# EAGLE design ice header adapter pcb (EAGLE 7.1.0)
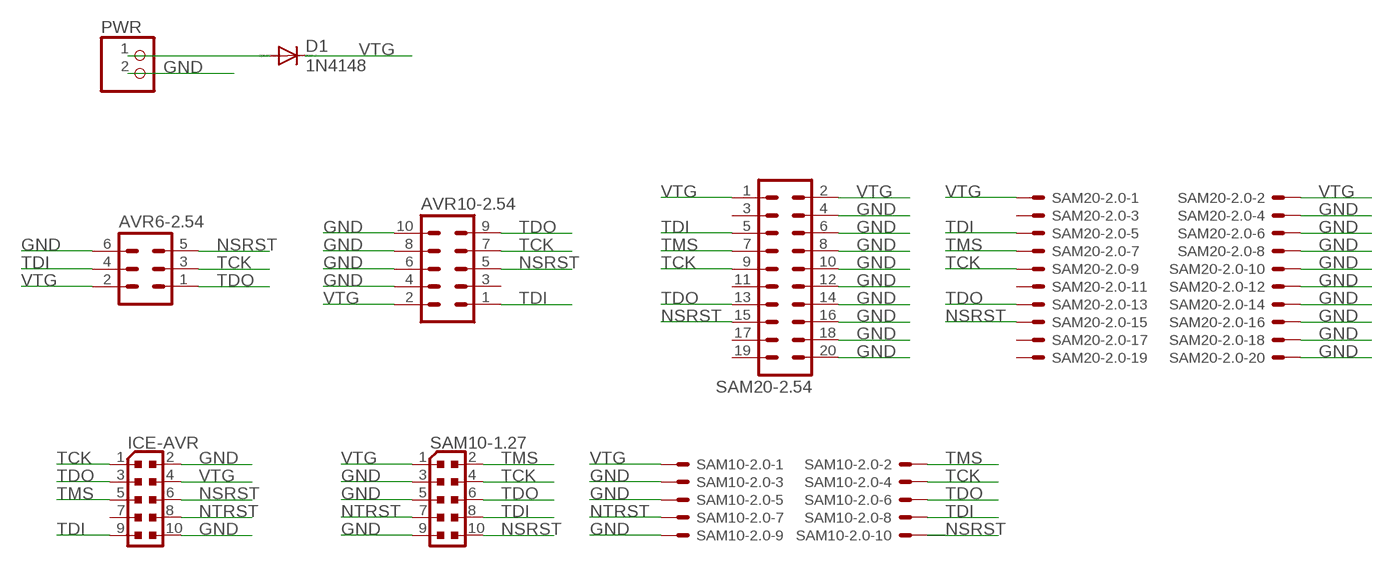
[diagram p0: schematic, sheet 1]

## Parts
AVR6-2.54  ML6  [ML6]
AVR10-2.54  ML10  [ML10]
D1  1N4148  1N4148DO35-7  [DO35-7]
ICE-AVR  PINHEAD_PINHD-2X5PASSO127  [PINHEAD_2X05_127]
PWR  PINHD-1X2/90  [1X02/90]
SAM10-1.27  PINHEAD_PINHD-2X5PASSO127  [PINHEAD_2X05_127]
SAM10-2.0  87758-1016  [87758-1016]
SAM20-2.0  87758-2016  [87758-2016]
SAM20-2.54  ML20  [ML20]

## Nets
GND [pwr]: AVR6-2.54.6 AVR10-2.54.4 AVR10-2.54.6 AVR10-2.54.8 AVR10-2.54.10 ICE-AVR.2 ICE-AVR.10 PWR.2 SAM10-1.27.3 SAM10-1.27.5 SAM10-1.27.9 SAM10-2.0.3 SAM10-2.0.5 SAM10-2.0.9 SAM20-2.0.4 SAM20-2.0.6 SAM20-2.0.8 SAM20-2.0.10 SAM20-2.0.12 SAM20-2.0.14 SAM20-2.0.16 SAM20-2.0.18 SAM20-2.0.20 SAM20-2.54.4 SAM20-2.54.6 SAM20-2.54.8 SAM20-2.54.10 SAM20-2.54.12 SAM20-2.54.14 SAM20-2.54.16 SAM20-2.54.18 SAM20-2.54.20
N$2: D1.A PWR.1
NSRST: AVR6-2.54.5 AVR10-2.54.5 ICE-AVR.6 SAM10-1.27.10 SAM10-2.0.10 SAM20-2.0.15 SAM20-2.54.15
NTRST: ICE-AVR.8 SAM10-1.27.7 SAM10-2.0.7
TCK: AVR6-2.54.3 AVR10-2.54.7 ICE-AVR.1 SAM10-1.27.4 SAM10-2.0.4 SAM20-2.0.9 SAM20-2.54.9
TDI: AVR6-2.54.4 AVR10-2.54.1 ICE-AVR.9 SAM10-1.27.8 SAM10-2.0.8 SAM20-2.0.5 SAM20-2.54.5
TDO: AVR6-2.54.1 AVR10-2.54.9 ICE-AVR.3 SAM10-1.27.6 SAM10-2.0.6 SAM20-2.0.13 SAM20-2.54.13
TMS: ICE-AVR.5 SAM10-1.27.2 SAM10-2.0.2 SAM20-2.0.7 SAM20-2.54.7
VTG [pwr]: AVR6-2.54.2 AVR10-2.54.2 D1.C ICE-AVR.4 SAM10-1.27.1 SAM10-2.0.1 SAM20-2.0.1 SAM20-2.0.2 SAM20-2.54.1 SAM20-2.54.2
Unconnected: AVR10-2.54.3 ICE-AVR.7 SAM20-2.0.3 SAM20-2.0.11 SAM20-2.0.17 SAM20-2.0.19 SAM20-2.54.3 SAM20-2.54.11 SAM20-2.54.17 SAM20-2.54.19

## Library data of the parts
AVR6-2.54 = con-harting-ml:ML6: HARTING; OC_FARNELL: unknown; OC_NEWARK: unknown
AVR10-2.54 = con-harting-ml:ML10: HARTING; OC_FARNELL: unknown; OC_NEWARK: unknown
D1 = diode:1N4148: DIODE high speed (Philips)
ICE-AVR SAM10-1.27 = Arduino_Wifi_shield_v018_tG:PINHEAD_PINHD-2X5: PIN HEADER
PWR = pinhead:PINHD-1X2: PIN HEADER
SAM10-2.0 = con-molex:87758-1016: 10 Pin - 2mm Dual Row Single Wafer, Vertical T/H HDR Source: http://www.molex.com/pdm_docs/sd/877580616_sd.pdf; MF: MOLEX; MPN: 87758-1016; OC_FARNELL: 7472340; OC_NEWARK: 59J1558
SAM20-2.0 = con-molex:87758-2016: 20 Pin - 2mm Dual Row Single Wafer, Vertical T/H HDR Source: http://www.molex.com/pdm_docs/sd/877580616_sd.pdf; MPN: 87758-2016; OC_FARNELL: 7472374; OC_NEWARK: 25M5677
SAM20-2.54 = con-harting-ml:ML20: HARTING; OC_FARNELL: unknown; OC_NEWARK: unknown

## Net classes
0 default: width 0.3 mm, drill 0.3 mm, clearance 0.3 mm
1 pwr: width 0.5 mm, drill 0.5 mm, clearance 0.3 mm

## Board
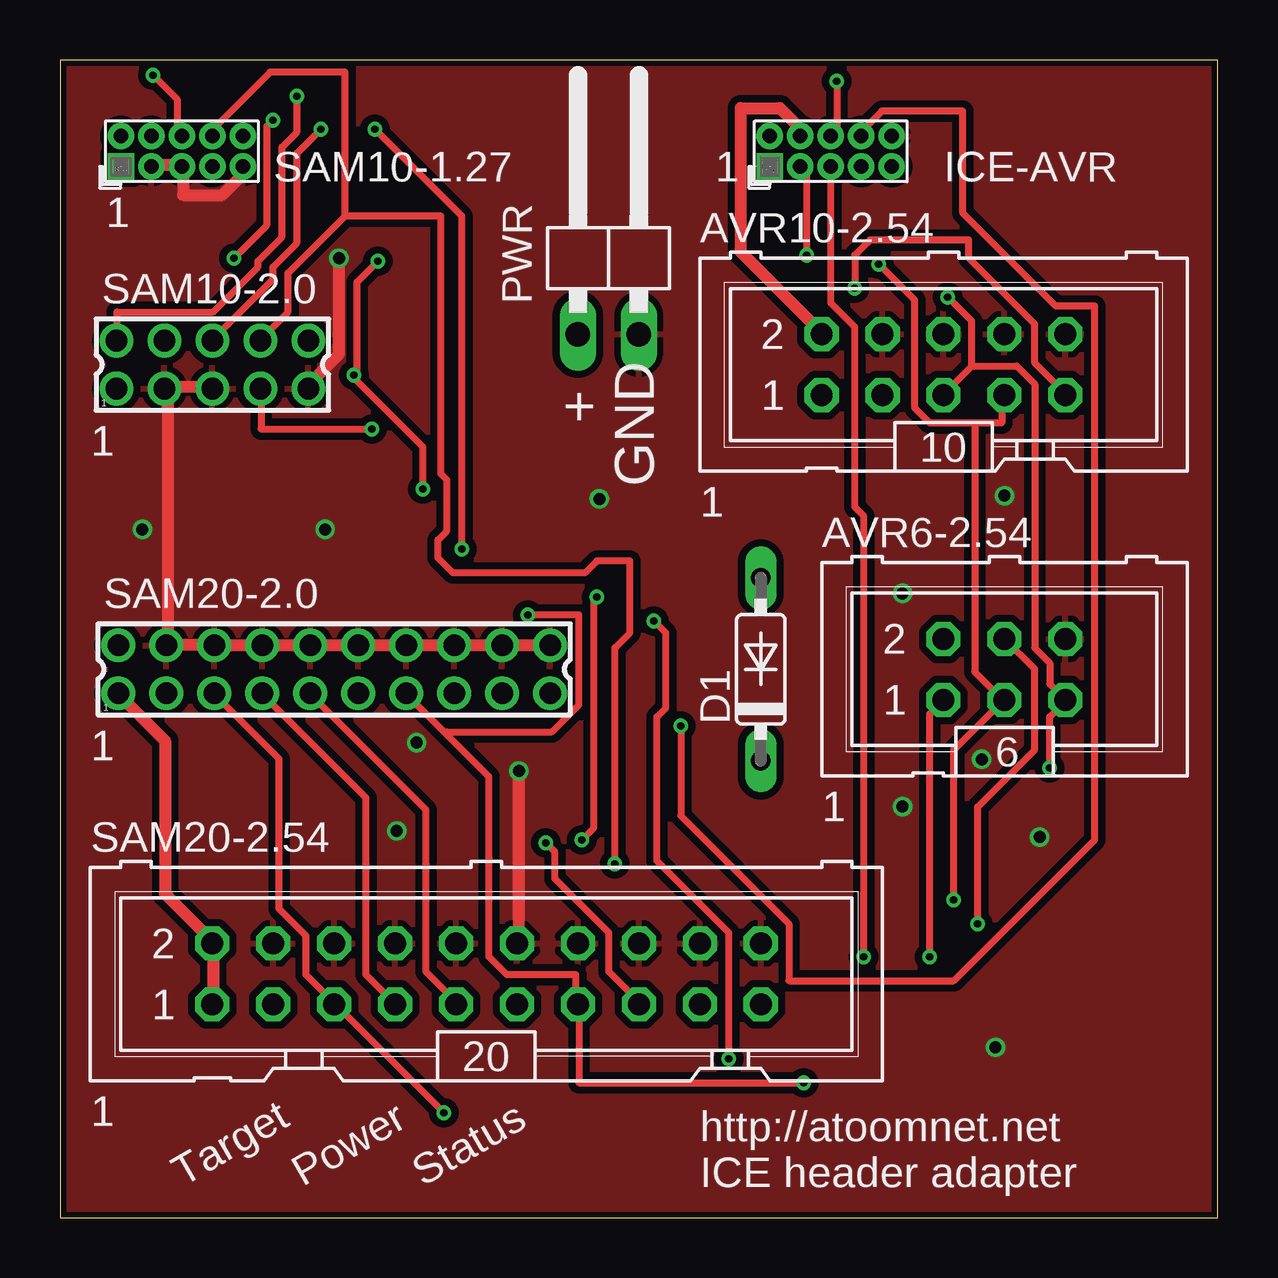
[diagram p1: board, top side]
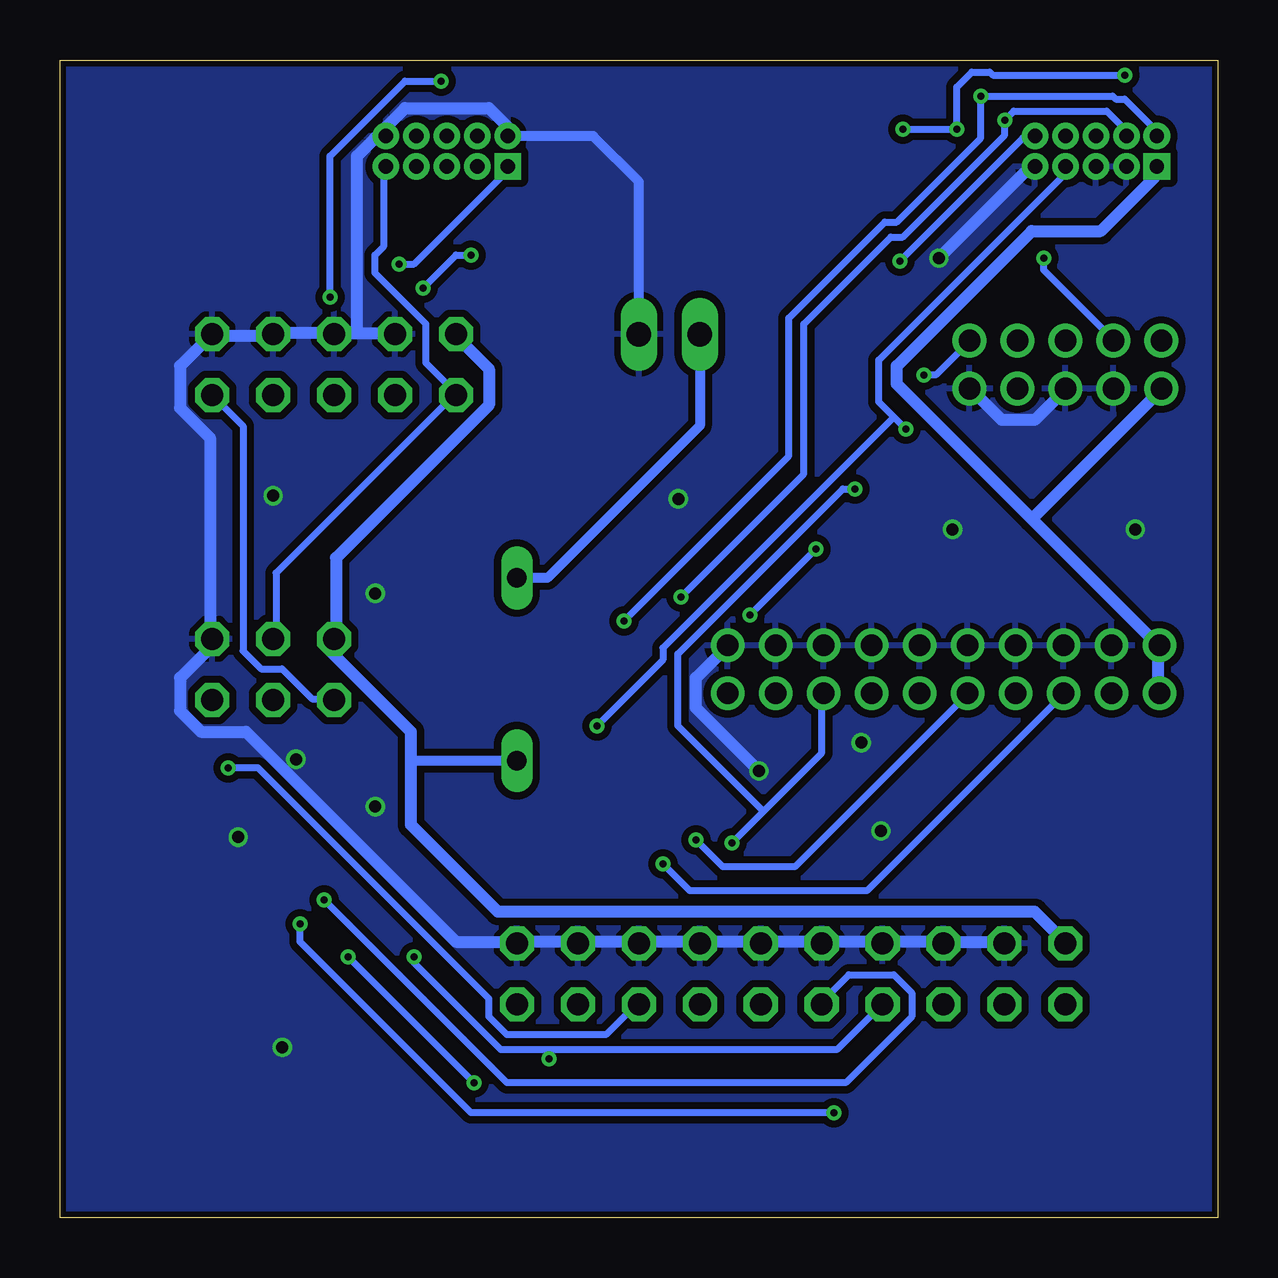
[diagram p2: board, bottom side, seen from below]

Size 48.26 x 48.26 mm. Coordinates in mm from the lower left corner, seen from the top.
Outline: 0,0 48.26,0 48.26,48.26 0,48.26 0,0
Copper layers (1*16): Top 0.035mm / dielectric 1.5mm / Bottom 0.035mm
Design rules "ITEADstudio_DRC-via-distance": minimum track width 6mil, minimum drill 12mil, track to track 6mil, track to pad 6mil, pad to pad 6mil, via to via 0.8mm, smd to smd 0mil, copper to edge 10mil, drill to drill 10mil, minimum pad ring 10mil, minimum via ring 6mil, stop-mask expansion 2mil, vias tented up to drill 100mil, thermal gap 10mil
vRestrict: area 8.9,43.2 to 20.3,44.5; area 1.3,38.1 to 11.4,39.4; area 1.3,25.4 to 11.4,26.7; area 1.3,15.2 to 12.7,16.5; area 31.8,27.9 to 41.9,29.2; area 26.7,40.6 to 38.1,41.9; area 26.7,43.2 to 27.9,44.5; area 36.8,43.2 to 44.5,44.5; area 1.9,41.3 to 2.5,42.5; area 1.3,31.8 to 2.5,33; area 1.3,19.1 to 2.5,20.3; area 1.3,3.8 to 2.5,5.1; 2 more areas

### Footprints (pad centres in the part's own frame; a part is rotated, then mirrored left to right if it is on the bottom)
ML6 = drill 0.914 octagon: 1 -2.54,-1.27; 2 -2.54,1.27; 3 0,-1.27; 4 0,1.27; 5 2.54,-1.27; 6 2.54,1.27
ML10 = drill 0.914 octagon: 1 -5.08,-1.27; 2 -5.08,1.27; 3 -2.54,-1.27; 4 -2.54,1.27; 5 0,-1.27; 6 0,1.27; 7 2.54,-1.27; 8 2.54,1.27; 9 5.08,-1.27; 10 5.08,1.27
DO35-7 = drill 0.813 long: A 3.81,0; C -3.81,0
PINHEAD_2X05_127 = drill 0.6 pad 1.016 square: 1 -0.635,2.54 | drill 0.6 pad 1.016: 2 0.635,2.54; 3 -0.635,1.27; 4 0.635,1.27; 5 -0.635,0; 6 0.635,0; 7 -0.635,-1.27; 8 0.635,-1.27; 9 -0.635,-2.54; 10 0.635,-2.54
1X02/90 = drill 1.016 long: 1 -1.27,-3.81; 2 1.27,-3.81
87758-1016 = drill 0.9 pad 1.27: 1 -4,-1; 2 -4,1; 3 -2,-1; 4 -2,1; 5 0,-1; 6 0,1; 7 2,-1; 8 2,1; 9 4,-1; 10 4,1
87758-2016 = drill 0.9 pad 1.27: 1 -9,-1; 2 -9,1; 3 -7,-1; 4 -7,1; 5 -5,-1; 6 -5,1; 7 -3,-1; 8 -3,1; 9 -1,-1; 10 -1,1; 11 1,-1; 12 1,1; 13 3,-1; 14 3,1; 15 5,-1; 16 5,1; 17 7,-1; 18 7,1; 19 9,-1; 20 9,1
ML20 = drill 0.914 octagon: 1 -11.43,-1.27; 2 -11.43,1.27; 3 -8.89,-1.27; 4 -8.89,1.27; 5 -6.35,-1.27; 6 -6.35,1.27; 7 -3.81,-1.27; 8 -3.81,1.27; 9 -1.27,-1.27; 10 -1.27,1.27; 11 1.27,-1.27; 12 1.27,1.27; 13 3.81,-1.27; 14 3.81,1.27; 15 6.35,-1.27; 16 6.35,1.27; 17 8.89,-1.27; 18 8.89,1.27; 19 11.43,-1.27; 20 11.43,1.27

### Placement (x,y rotation side)
AVR6-2.54  39.37,22.86 0 top
AVR10-2.54  36.83,35.56 0 top
D1  29.21,22.86 90 top
ICE-AVR  32.13,44.45 90 top
PWR  22.86,40.64 0 top
SAM10-1.27  5.08,44.45 90 top
SAM10-2.0  6.35,35.56 0 top
SAM20-2.0  11.43,22.86 0 top
SAM20-2.54  17.78,10.16 0 top

### Tracks (layer width: path | path; a pad name or v marks a point on that pad's centre or on a via)
GND  (via drill 0.5)
  Top 0.5: SAM10-1.27.3 3.88,43.88 5,43.88 SAM10-1.27.5 5.12,43.62 5.12,42.62 6.75,42.62 7.5,43.38 7.5,43.75 SAM10-1.27.9 | SAM10-2.0.5 6.25,34.62 4.38,34.62 SAM10-2.0.3 4.5,34.38 4.5,24.12 SAM20-2.0.4 4.5,23.88 6.38,23.88 SAM20-2.0.6 6.62,23.88 8.38,23.88 SAM20-2.0.8 8.62,23.88 10.38,23.88 SAM20-2.0.10 10.62,23.88 12.38,23.88 SAM20-2.0.12 12.62,23.88 14.38,23.88 SAM20-2.0.14 14.62,23.88 16.38,23.88 SAM20-2.0.16 16.62,23.88 18.38,23.88 SAM20-2.0.18 18.62,23.88 20.38,23.88 SAM20-2.0.20 | v11.62,40 11.62,36 10.38,34.75 10.38,34.62 SAM10-2.0.9 | v19.12,18.62 19.12,11.5 SAM20-2.54.12
  Bottom 0.406: PWR.2 24.13,43.18 26.04,45.09 ICE-AVR.2
  Bottom 0.5: SAM10-2.0.9 10.25,34.5 9,33.25 7.62,33.25 6.38,34.5 SAM10-2.0.5 | v11.62,40 7.88,43.75 7.62,43.75 SAM10-1.27.9 | SAM20-2.54.4 9,11.5 11.38,11.5 SAM20-2.54.6 11.62,11.5 13.88,11.5 SAM20-2.54.8 14.12,11.5 16.5,11.5 SAM20-2.54.10 16.75,11.5 19,11.5 SAM20-2.54.12 19.25,11.5 21.5,11.5 SAM20-2.54.14 21.75,11.5 24.12,11.5 SAM20-2.54.16 24.38,11.5 26.62,11.5 SAM20-2.54.18 26.88,11.5 29.12,11.5 SAM20-2.54.20 29.38,11.5 31.75,11.5 40.5,20.25 42.38,20.25 43.25,21.12 43.25,22.5 41.88,23.88 AVR6-2.54.6 42,24.25 42,32.5 43.25,33.75 43.25,35.5 42,36.75 AVR10-2.54.10 41.75,36.75 39.5,36.75 AVR10-2.54.8 39.25,36.88 37,36.88 AVR10-2.54.6 36.75,36.88 35.88,36.88 | ICE-AVR.2 29.62,45.12 29.62,45.5 30.38,46.25 33.88,46.25 34.62,45.5 34.62,45.12 ICE-AVR.10 34.88,45 35.12,45 35.88,44.25 35.88,36.88 | 35.88,36.88 34.38,36.88 AVR10-2.54.4 | v19.12,18.62 21.75,21.25 21.75,22.5 20.5,23.75 SAM20-2.0.20
  other vias: 40.84,15.87 35.12,17.14 35.12,26.03 39.37,30.09 3.43,28.7 11.05,28.7 14.86,19.81 14.04,16.12 22.48,29.97 38.99,7.11 38.42,19.11
  pour Top: -1.27,49.53 49.53,49.53 49.53,-1.27 -1.27,-1.27
  pour Bottom: -2.54,50.8 50.8,50.8 50.8,-2.54 -2.54,-2.54
N$2
  Bottom 0.406: PWR.1 21.59,33.02 27.94,26.67 D1.A
NSRST  (via drill 0.3)
  Top 0.3: v32.38,47.38 32.38,45.25 32.25,45.12 ICE-AVR.6 | v37,38.38 38,37.38 38,35.5 | 38,35.5 36.88,34.38 AVR10-2.54.5 | 38,35.5 39.88,35.5 40.62,34.75 40.62,23.75 41.25,23.12 41.25,22.25 AVR6-2.54.5 41.88,21.5 41.25,20.88 v41.25,18.75 | v13.25,39.88 12.38,39 12.38,35.25 v12.25,35.12 12.25,35 15.12,32.12 v15.12,30.38 | v20.25,15.62 20.62,15.25 20.62,14.12 22.88,11.88 22.88,10.25 24.12,9 SAM20-2.54.15
  Bottom 0.3: v32.38,47.38 33.88,47.38 37,44.25 v37,38.38 | v13.25,39.88 8.12,45 7.62,45 SAM10-1.27.10 | v12.25,35.12 11.75,35.12 10.38,36.5 SAM10-2.0.10 | v20.25,15.62 18.94,16.94 | 18.94,16.94 16.5,19.38 16.5,21.75 SAM20-2.0.15 | v15.12,30.38 15.62,30.38 22.5,23.5 22.5,20.5 18.94,16.94 | v41.25,18.75 40,18.75 30.38,9.12 30.38,8.38 29.62,7.62 25.5,7.62 24.25,8.88 SAM20-2.54.15
NTRST  (via drill 0.3)
  Top 0.3: v13,32.88 8.38,32.88 8.38,34.5 SAM10-2.0.7 | v25.88,20.5 25.88,16.75 30.38,12.25 30.38,9.88 37.25,9.88 43.12,15.75 43.12,38 41.5,38 37.62,41.88 37.62,46.12 34.25,46.12 33.62,45.5 33.62,45.25 33.5,45.12 ICE-AVR.8
  Bottom 0.3: v13,32.88 13.5,33.38 | 13.5,33.38 14.12,34 14.12,35.75 6.38,43.5 6.38,43.75 SAM10-1.27.7 | v25.88,20.5 23.12,23.25 23.12,23.75 13.5,33.38
TCK  (via drill 0.3)
  Top 0.3: v34.12,39.75 35.62,38.25 35.62,33.75 36.25,33.12 38.12,33.12 | 38.12,33.12 39.25,33.12 39.25,34.25 AVR10-2.54.7 | 38.12,33.12 38.12,22.75 39.25,21.62 AVR6-2.54.3 39.25,21.5 37.25,19.5 v37.25,13.25 | v8.88,45.75 8.62,45.5 8.62,41.38 v7.25,40 | SAM20-2.0.9 10.5,21.75 15.25,17 15.25,10.25 16.5,9 SAM20-2.54.9 | v22.38,25.88 22.25,25.75 22.25,16.25 v21.75,15.75
  Bottom 0.3: v34.12,39.75 33.5,39.75 29.62,43.62 29.62,43.75 ICE-AVR.1 | v7.25,40 7.25,39.5 4.38,36.62 SAM10-2.0.4 | SAM10-1.27.4 3.88,45.12 3.88,45.38 4.62,46.12 8.5,46.12 v8.88,45.75 8.88,45.12 13.12,40.88 13.62,40.88 17.25,37.25 17.25,31 v22.38,25.88 | v21.75,15.75 20.62,14.62 17.62,14.62 10.5,21.75 SAM20-2.0.9 | v37.25,13.25 29.62,5.62 15.5,5.62 12.75,8.38 12.75,9.38 13.5,10.12 15.38,10.12 16.5,9 SAM20-2.54.9
TDI  (via drill 0.3)
  Top 0.3: 11.88,41.75 11.88,47.75 8.75,47.75 6.5,45.5 6.5,45.25 6.38,45.12 SAM10-1.27.8 | 11.88,41.75 9.5,39.38 9.5,37.75 8.38,36.62 SAM10-2.0.8 | SAM20-2.0.5 6.5,21.75 9.12,19.12 9.12,12.88 10.25,11.75 10.25,10.12 11.38,9 SAM20-2.54.5 11.5,8.88 v16,4.38 | 11.88,41.75 15.88,41.75 15.88,31 16.12,30.75 16.12,28.62 15.75,28.25 15.75,27.5 16.38,26.88 21.88,26.88 22.38,27.38 23.75,27.38 23.75,24.38 23.12,23.75 v23.12,14.75 | AVR6-2.54.4 40.62,22.88 40.62,19.5 38.25,17.12 v38.25,12.25
  Bottom 0.3: ICE-AVR.9 34.75,43.75 34.75,40.5 35.12,40.12 35.12,39.38 33,37.25 33,35.62 31.75,34.38 AVR10-2.54.1 31.88,34.25 39.25,26.88 39.25,24.25 AVR6-2.54.4 | v23.12,14.75 22,13.62 14.62,13.62 6.5,21.75 SAM20-2.0.5 | v38.25,12.25 38.25,11.5 31.12,4.38 v16,4.38
TDO  (via drill 0.3)
  Top 0.3: v31.12,40.12 31.12,43.5 30.88,43.75 ICE-AVR.3 | v33.12,38.75 33.12,40.12 33.75,40.75 37.88,40.75 37.88,40 40.62,37.25 40.62,35.62 41.88,34.38 AVR10-2.54.9 | v3.88,47.62 4.88,46.62 4.88,45.25 5,45.12 SAM10-1.27.6 | v10.88,45.38 9.88,44.38 9.88,40.62 8.88,39.62 8.88,39.12 6.38,36.62 SAM10-2.0.6 | 16.06,20.19 17.88,18.38 17.88,10.88 18.62,10.12 21.5,10.12 21.5,9 SAM20-2.54.13 21.62,8.75 21.62,5.62 v31,5.62 | 16.06,20.19 14.5,21.75 SAM20-2.0.13 | v13.12,45.38 16.75,41.75 v16.75,27.88 | v19.5,25.12 21.62,25.12 21.62,21.38 20.5,20.25 16.12,20.25 16.06,20.19 | v36.25,10.88 36.25,21 36.75,21.5 AVR6-2.54.1
  Bottom 0.3: v31.12,40.12 31.75,40.12 v33.12,38.75 | AVR6-2.54.1 36.88,21.62 37.75,21.62 39,22.88 39.88,22.88 40.62,23.62 40.62,33 41.88,34.25 AVR10-2.54.9 | v3.88,47.62 9.38,47.62 9.5,47.75 10.25,47.75 10.88,47.12 v10.88,45.38 v13.12,45.38 | v19.5,25.12 v16.75,27.88 | v31,5.62 v36.25,10.88
TMS  (via drill 0.3)
  Top 0.3: v9.88,46.75 9.88,45.25 9.25,44.62 9.25,40.88 8.25,39.88 8.25,39.62 6.38,37.75 2.38,37.75 2.38,36.62 SAM10-2.0.2 | v33.5,10.88 33.5,29.25 33.12,29.62 33.12,37.12 32.12,38.12 32.12,43.75 ICE-AVR.5 | SAM20-2.0.7 8.5,21.75 12.75,17.5 12.75,10.12 13.88,9 SAM20-2.54.7 | v24.75,24.88 25.25,24.38 25.25,21.25 24.88,20.88 24.88,14.88 27.88,11.88 v27.88,6.62
  Bottom 0.3: SAM10-1.27.2 2.62,45.12 2.62,45.38 3.88,46.62 4.25,46.62 4.38,46.75 v9.88,46.75 9.88,45 13.38,41.5 13.88,41.5 17.88,37.5 17.88,31.75 v24.75,24.88 | v33.5,10.88 33.5,10.62 29.88,7 27.88,7 | 27.88,7 15.88,7 14,8.88 SAM20-2.54.7 | 27.88,7 v27.88,6.62
VTG
  Top 0.5: ICE-AVR.4 30.75,45.12 30.75,45.5 30,46.25 28.38,46.25 28.38,40.25 31.75,36.88 AVR10-2.54.2 | SAM20-2.54.1 6.38,9 6.38,11.38 SAM20-2.54.2 6.25,11.62 4.38,13.5 4.38,19.88 2.5,21.75 SAM20-2.0.1
  Bottom 0.406: D1.C 33.62,19.05
  Bottom 0.5: AVR10-2.54.2 31.75,36.75 30.38,35.38 30.38,33.88 36.75,27.5 36.75,24.25 AVR6-2.54.2 36.88,23.88 36.88,23.5 33.62,20.25 33.62,19.05 33.62,16.38 30,12.75 7.62,12.75 6.38,11.5 SAM20-2.54.2 | 7.75,29.12 2.5,23.88 SAM20-2.0.2 2.5,23.62 2.5,21.88 SAM20-2.0.1 | 7.75,29.12 13.38,34.75 13.38,35.5 7.75,41.12 4.88,41.12 2.62,43.38 2.62,43.75 SAM10-1.27.1 | 7.75,29.12 2.38,34.5 SAM10-2.0.1

### Text on the board
tNames: SAM10-1.27 | 1 | ICE-AVR | 1 | + | 1 | GND | 1 | 1 | 1 | 1 | Target | Power | Status | http://atoomnet.net / ICE header adapter